# EAGLE schematic RasPi_Controller_RHD_Rev3_GND_Stitch (EAGLE 9.6.2)
REV: 1
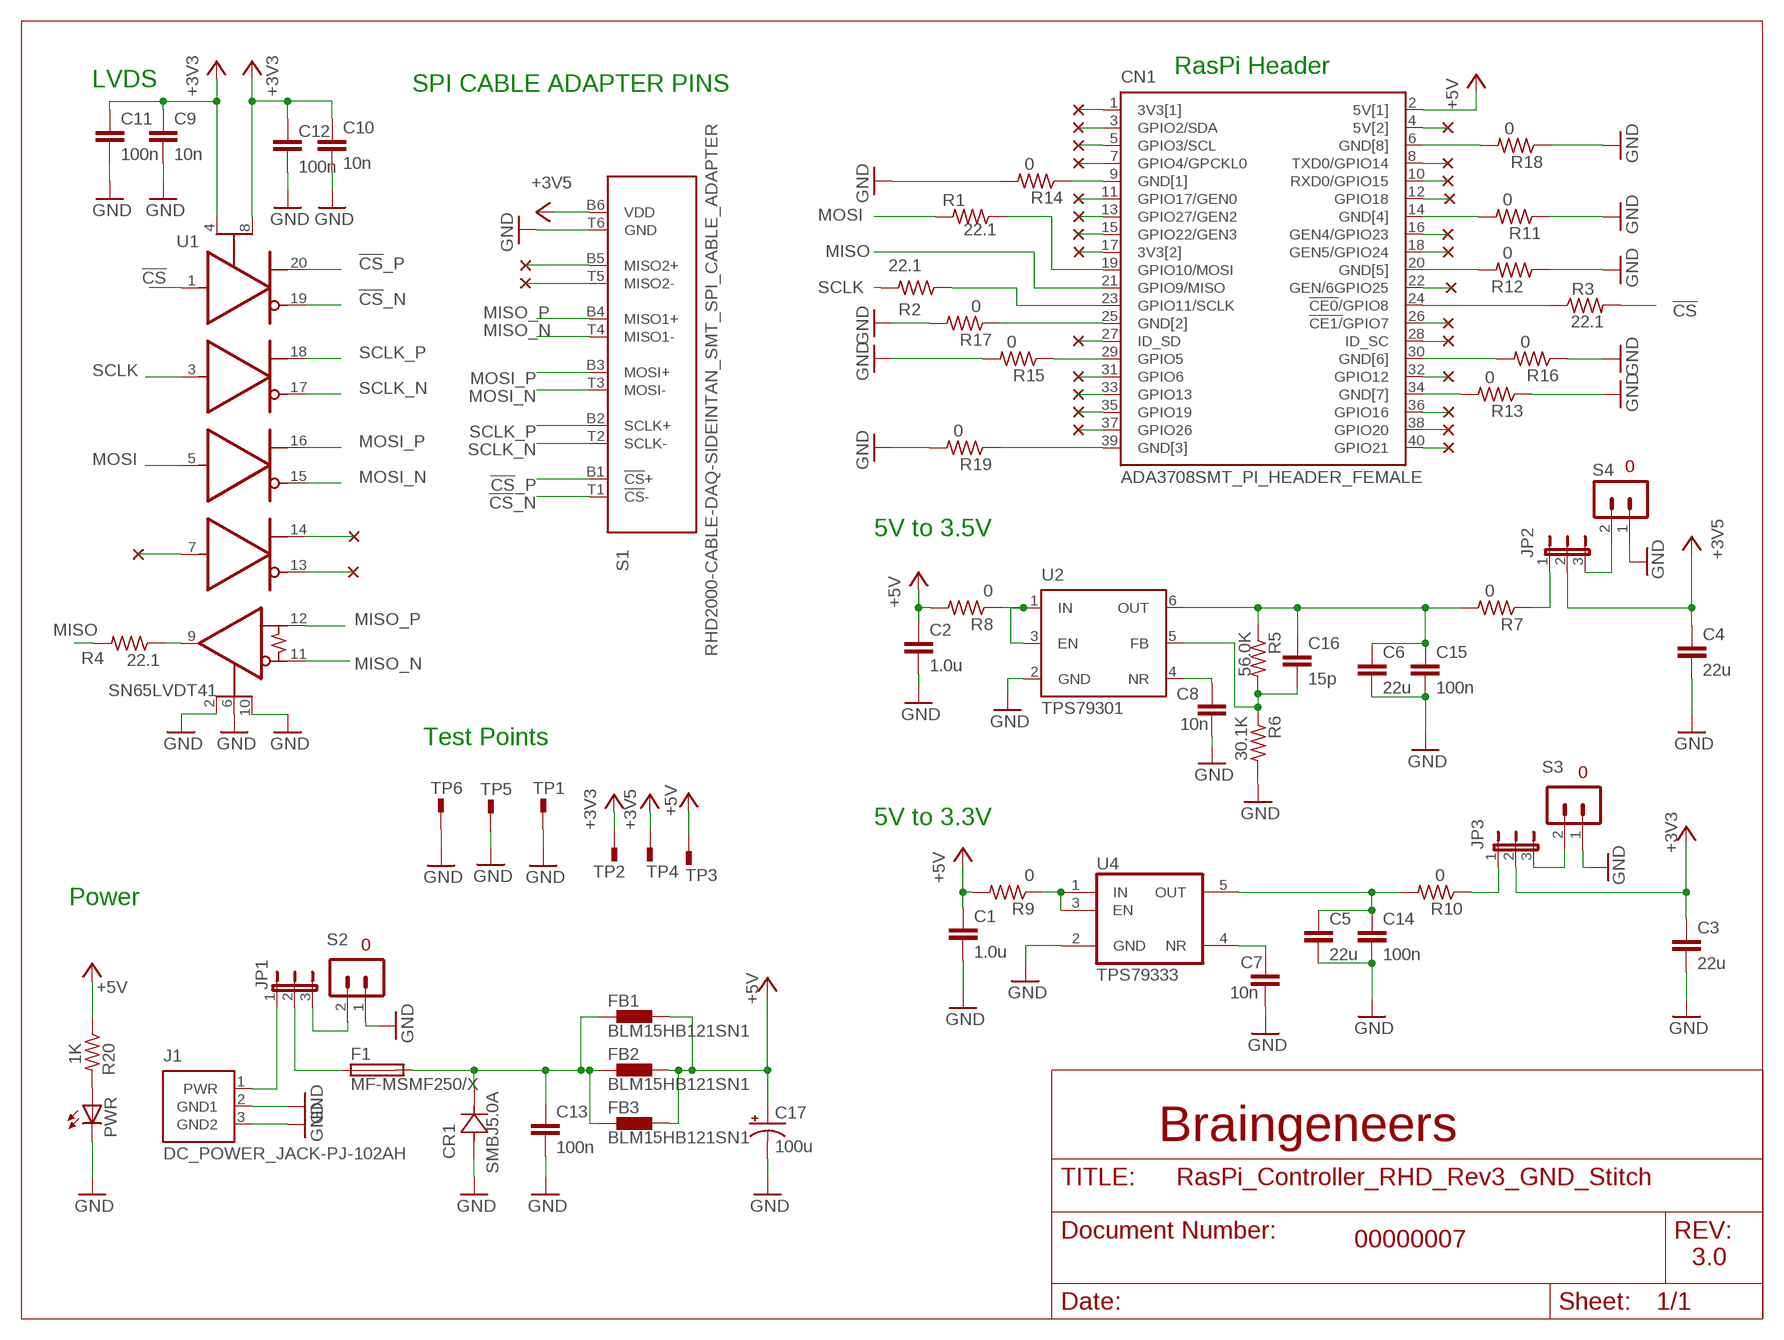
[diagram p0: schematic, sheet 1]

## Parts
C1  1.0u  C_0603  [0603]
C2  1.0u  C_0603  [0603]
C3  22u  C_0603  [0603]
C4  22u  C_0603  [0603]
C5  22u  C_0603  [0603]
C6  22u  C_0603  [0603]
C7  10n  C_0201  [0201]
C8  10n  C_0201  [0201]
C9  10n  C_0201  [0201]
C10  10n  C_0201  [0201]
C11  100n  C_0201  [0201]
C12  100n  C_0201  [0201]
C13  100n  C_0201  [0201]
C14  100n  C_0201  [0201]
C15  100n  C_0201  [0201]
C16  15p  C_0201  [0201]
C17  100u  EEE-HAE101XAP  [EEE-HAE101XAP]
CN1  ADA3708SMT_PI_HEADER_FEMALE  [SAMTEC-HLE-120-02-X-DV]
CR1  SMBJ5.0A  [DIODE_DO214AA]
F1  MF-MSMF250/X  [MF-MSMF250/16X-2]
FB1  BLM15HB121SN1  [0402]
FB2  BLM15HB121SN1  [0402]
FB3  BLM15HB121SN1  [0402]
J1  DC_POWER_JACK-PJ-102AH  [PJ-102AH]
JP1  JP2E  [JP2]
JP2  JP2E  [JP2]
JP3  JP2E  [JP2]
PWR  LEDCHIPLED_0603  [CHIPLED_0603]
R1  22.1  R_0402  [0402]
R2  22.1  R_0402  [0402]
R3  22.1  R_0402  [0402]
R4  22.1  R_0402  [0402]
R5  56.0K  R_0402  [0402]
R6  30.1K  R_0402  [0402]
R7  0  R_0402  [0402]
R8  0  R_0402  [0402]
R9  0  R_0402  [0402]
R10  0  R_0402  [0402]
R11  0  R_0402  [0402]
R12  0  R_0402  [0402]
R13  0  R_0402  [0402]
R14  0  R_0402  [0402]
R15  0  R_0402  [0402]
R16  0  R_0402  [0402]
R17  0  R_0402  [0402]
R18  0  R_0402  [0402]
R19  0  R_0402  [0402]
R20  1K  R_0402  [0402]
S1  RHD2000-CABLE-DAQ-SIDEINTAN_SMT_SPI_CABLE_ADAPTER  [INTAN_SMT_RHD_SPI_CABLE_ADAPTER]
S2  TERMINAL_BLOCK_2-3.5MM-5V  [TERMINAL_BLOCK_3.5MM_2_5V]
S3  TERMINAL_BLOCK_2-3.5MM-3.3V  [TERMINAL_BLOCK_3.5MM_2_3.3V]
S4  TERMINAL_BLOCK_2-3.5MM-3.5V  [TERMINAL_BLOCK_3.5MM_2_3.5V]
TP1  5016  [5016]
TP2  5016  [5016]
TP3  5016  [5016]
TP4  5016  [5016]
TP5  5016  [5016]
TP6  5016  [5016]
U1  SN65LVDT41  [TSSOP-20]
U2  TPS79301  [SOT-23-6]
U4  TPS79333  [TSOT-23-5]
U$2  NOCONNECTION  (no package)
U$3  NOCONNECTION  (no package)
U$4  NOCONNECTION  (no package)
U$5  NOCONNECTION  (no package)
U$6  NOCONNECTION  (no package)
U$8  NOCONNECTION  (no package)
U$9  NOCONNECTION  (no package)
U$10  NOCONNECTION  (no package)
U$12  NOCONNECTION  (no package)
U$13  NOCONNECTION  (no package)
U$15  NOCONNECTION  (no package)
U$17  NOCONNECTION  (no package)
U$19  NOCONNECTION  (no package)
U$20  NOCONNECTION  (no package)
U$22  NOCONNECTION  (no package)
U$23  NOCONNECTION  (no package)
U$24  NOCONNECTION  (no package)
U$25  NOCONNECTION  (no package)
U$26  NOCONNECTION  (no package)
U$27  NOCONNECTION  (no package)
U$28  NOCONNECTION  (no package)
U$29  NOCONNECTION  (no package)
U$30  NOCONNECTION  (no package)
U$37  NOCONNECTION  (no package)
U$39  NOCONNECTION  (no package)
U$40  NOCONNECTION  (no package)
U$41  NOCONNECTION  (no package)
U$43  NOCONNECTION  (no package)
U$45  NOCONNECTION  (no package)
U$46  NOCONNECTION  (no package)
U$47  NOCONNECTION  (no package)

## Nets
!CS!: R3.2 U1.1(1D)
!CS!_N [diff pairs]: S1.T1(!CS!-) U1.19(1Z)
!CS!_P [diff pairs]: S1.B1(!CS!+) U1.20(1Y)
+3V3 [power]: C3.1 C9.1 C10.1 C11.1 C12.1 JP3.2 TP2.P$1 U1.4(VCC1) U1.8(VCC2)
+3V3_REG [power]: C5.1 C14.1 R10.2 U4.5(OUT)
+3V5: C4.1 JP2.2 S1.B6(VDD) TP4.P$1
+5V [power]: C1.1 C2.1 C17.1(+) CN1.2(5V[1]) FB1.2 FB2.2 FB3.2 R8.2 R9.2 R20.1 TP3.P$1
+5V_JACK [power]: J1.1(PWR) JP1.1
GND [power]: C1.2 C2.2 C3.2 C4.2 C5.2 C6.2 C7.2 C8.2 C9.2 C10.2 C11.2 C12.2 C13.2 C14.2 C15.2 C17.2(-) CR1.2 J1.2(GND1) J1.3(GND2) PWR.C R6.2 R11.1 R12.1 R13.1 R14.2 R15.2 R16.1 R17.2 R18.1 R19.2 S1.T6(GND) S2.1 S3.1 S4.1 TP1.P$1 TP5.P$1 TP6.P$1 U1.2(GND1) U1.6(GND2) U1.10(GND3) U2.2(GND) U4.2(GND)
MISO: CN1.21(GPIO9/MISO) R4.2
MISO_N [diff pairs]: S1.T4(MISO1-) U1.11(5B)
MISO_P [diff pairs]: S1.B4(MISO1+) U1.12(5A)
MOSI: R1.2 U1.5(3D)
MOSI_N [diff pairs]: S1.T3(MOSI-) U1.15(3Z)
MOSI_P [diff pairs]: S1.B3(MOSI+) U1.16(3Y)
N$1: U1.7(4D) U$2.P$1
N$2: C13.1 CR1.1 F1.P$2 FB1.1 FB2.1 FB3.1
N$3 [diff pairs]: U1.13(4Z) U$3.P$1
N$4: CN1.6(GND[8]) R18.2
N$5: CN1.30(GND[6]) R16.2
N$6 [diff pairs]: U1.14(4Y) U$4.P$1
N$7: CN1.8(TXD0/GPIO14) U$8.P$1
N$8: C8.1 U2.4(NR)
N$9: PWR.A R20.2
N$10: S1.B5(MISO2+) U$39.P$1
N$11: CN1.37(GPIO26) U$45.P$1
N$12: CN1.33(GPIO13) U$6.P$1
N$13: CN1.35(GPIO19) U$5.P$1
N$14 [power]: CN1.25(GND[2]) R17.1
N$15: CN1.27(ID_SD) U$17.P$1
N$16: CN1.29(GPIO5) R15.1
N$17: CN1.7(GPIO4/GPCKL0) U$22.P$1
N$18 [power]: CN1.9(GND[1]) R14.1
N$19: CN1.11(GPIO17/GEN0) U$20.P$1
N$20: CN1.13(GPIO27/GEN2) U$19.P$1
N$21: CN1.3(GPIO2/SDA) U$24.P$1
N$22: CN1.5(GPIO3/SCL) U$23.P$1
N$23 [power]: CN1.1(3V3[1]) U$25.P$1
N$24: CN1.15(GPIO22/GEN3) U$26.P$1
N$25: S1.T5(MISO2-) U$40.P$1
N$26: CN1.10(RXD0/GPIO15) U$9.P$1
N$27: CN1.12(GPIO18) U$10.P$1
N$28 [power]: CN1.14(GND[4]) R11.2
N$29: CN1.16(GEN4/GPIO23) U$12.P$1
N$30: CN1.20(GND[5]) R12.2
N$31: CN1.22(GEN/6GPIO25) U$29.P$1
N$32: CN1.18(GEN5/GPIO24) U$13.P$1
N$33 [power]: CN1.4(5V[2]) U$30.P$1
N$34: CN1.40(GPIO21) U$47.P$1
N$35: CN1.38(GPIO20) U$46.P$1
N$36: CN1.36(GPIO16) U$43.P$1
N$37 [power]: CN1.34(GND[7]) R13.2
N$38: JP1.3 S2.2
N$39: C16.2 R5.2 R6.1 U2.5(FB)
N$40: C7.1 U4.4(NR)
N$42 [power]: R9.1 U4.1(IN) U4.3(EN)
N$43 [power]: R8.1 U2.1(IN) U2.3(EN)
N$44: F1.P$1 JP1.2
N$45: JP3.3 S3.2
N$46: JP2.3 S4.2
N$47: JP2.1 R7.1
N$48: JP3.1 R10.1
N$49: CN1.23(GPIO11/SCLK) R2.1
N$50: CN1.24(!CE0!/GPIO8) R3.1
N$51: R4.1 U1.9(5R)
N$52 [power]: CN1.39(GND[3]) R19.1
N$53: CN1.31(GPIO6) U$15.P$1
N$54 [power]: CN1.17(3V3[2]) U$27.P$1
N$55: CN1.32(GPIO12) U$41.P$1
N$56: CN1.19(GPIO10/MOSI) R1.1
N$57: CN1.28(ID_SC) U$37.P$1
N$58: CN1.26(!CE1/!GPIO7) U$28.P$1
SCLK: R2.2 U1.3(2D)
SCLK_N [diff pairs]: S1.T2(SCLK-) U1.17(2Z)
SCLK_P [diff pairs]: S1.B2(SCLK+) U1.18(2Y)
U2_OUT [power]: C6.1 C15.1 C16.1 R5.1 R7.2 U2.6(OUT)

## Notes on the sheet
- RasPi Header
- LVDS | SPI CABLE ADAPTER PINS
- 5V to 3.5V
- Test Points
- 5V to 3.3V
- Power
- Braingeneers
- 00000007
- 3.0

## Library data of the parts
C1-C6 = Braingeneers_Lib:C: Capacitor
C7-C16 = RHD2000_eval_board:C: Capacitor
C17 = Braingeneers_Lib:EEE-HAE101XAP; CAPACITOR: 100u
CN1 = Braingeneers_Lib:ADA3708: Raspberry Pi Zero WH (Zero W with Headers)
CR1 = Braingeneers_Lib:SMBJ5.0A; BUILT_BY: EMA_UL_Team; MANUFACTURER_PART_NUMBER: SMBJ5.0A; SOURCELIBRARY: Bourns_2014-12-31; VENDOR: Bourns Electronics
F1 = Braingeneers_Lib:MF-MSMF250/X
FB1-FB3 = inductors:BLM15H: EMIFIL (R) Chip Ferrite Bead for GHz Noise Source: http://www.murata.com/ Ferrite Bead BLM15H.pdf
J1 = Braingeneers_Lib:DC_POWER_JACK: DC Power Jack
JP1-JP3 = jumper:JP2E: JUMPER
PWR = adafruit:LED: LED OSRAM: - CHIPLED LG R971, LG N971, LY N971, LG Q971, LY Q971, LO R971, LY R971 LH N974, LH R974 LS Q976, LO Q976, LY Q976 LO Q996 - Hyper CHIPLED LW Q18S LB Q993, LB Q99A, LB R99A - SideLED LS A670, LO A670, LY A670, LG A670, LP A670 LB A673, LV A673, LT A673, LW A673 LH A674 LY A675 LS A676, LA A676, LO A676, LY A676, LW A676 LS A679, LY A679, LG A679 - Hyper Micro SIDELED® LS Y876, LA Y876, LO Y876, LY Y876 LT Y87S - SmartLED LW L88C, LW L88S LB L89C, LB L89S, LG L890 LS L89K, LO L89K, LY L89K LS L896, LA L896, LO L896, LY L896 - TOPLED LS T670, LO T670, LY T670, LG T670, LP T670 LSG T670, LSP T670, LSY T670, LOP T670, LYG T670 LG T671, LOG T671, LSG T671 LB T673, LV T673, LT T673, LW T673 LH T674 LS T676, LA T676, LO T676, LY T676, LB T676, LH T676, LSB T676, LW T676 LB T67C, LV T67C, LT T67C, LS T67K, LO T67K, LY T67K, LW E67C LS E67B, LA E67B, LO E67B, LY E67B, LB E67C, LV E67C, LT E67C LW T67C LS T679, LY T679, LG T679 LS T770, LO T770, LY T770, LG T770, LP T770 LB T773, LV T773, LT T773, LW T773 LH T774 LS E675, LA E675, LY E675, LS T675 LS T776, LA T776, LO T776, LY T776, LB T776 LHGB T686 LT T68C, LB T68C - Hyper Mini TOPLED® LB M676 - Mini TOPLED Santana® LG M470 LS M47K, LO M47K, LY M47K Source: http://www.osram.convergy.de/
R1-R20 = RHD2000_eval_board:R: Resistor
S1 = Braingeneers_Lib:RHD2000-CABLE-DAQ-SIDE: Omnetics A79623 PZN-12-AA connector for SPI interface (controller side)
S2-S4 = Braingeneers_Lib:TERMINAL_BLOCK_2: 2-point terminal block
TP1-TP6 = RHD2000:5016
U1 = Braingeneers_Lib:SN65LVDT41
U2 = RHD2000_eval_board:TPS79301: Texas Instruments TPS79301 adjustable regulator
U4 = harrison:TPS79333
U$2-U$6 U$8-U$10 U$12 U$13 U$15 U$17 U$19 U$20 U$22-U$30 U$37 U$39-U$41 U$43 U$45-U$47 = Braingeneers_Lib:NOCONNECTION: A No Connection symbol only Handy to use on those pins that you want to mark as NC on a schematic.

## Net classes
0 default: width 0.152 mm
1 thick: width 0.254 mm
2 power: width 0.61 mm
3 diff pairs: width 0.152 mm